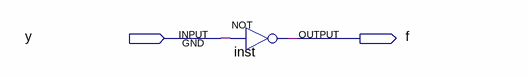
[diagram p0: schematic sheet]
// Quartus schematic 2-1-1-after.bdf as structural Verilog: 1 symbols, 2 pins
module \2-1-1-after  (
  input  y,
  output f
);

  not inst (f, y);
endmodule
